# EasyEDA schematic ArduinoFile Schematic v2.json
TITLE: ProFile Interface Adapter - Arduino Mega Version; REV: 1.0; Date: 2021-08-20; Sheet: 1/1; Drawn By: AlexTheCat123; Company: N/A
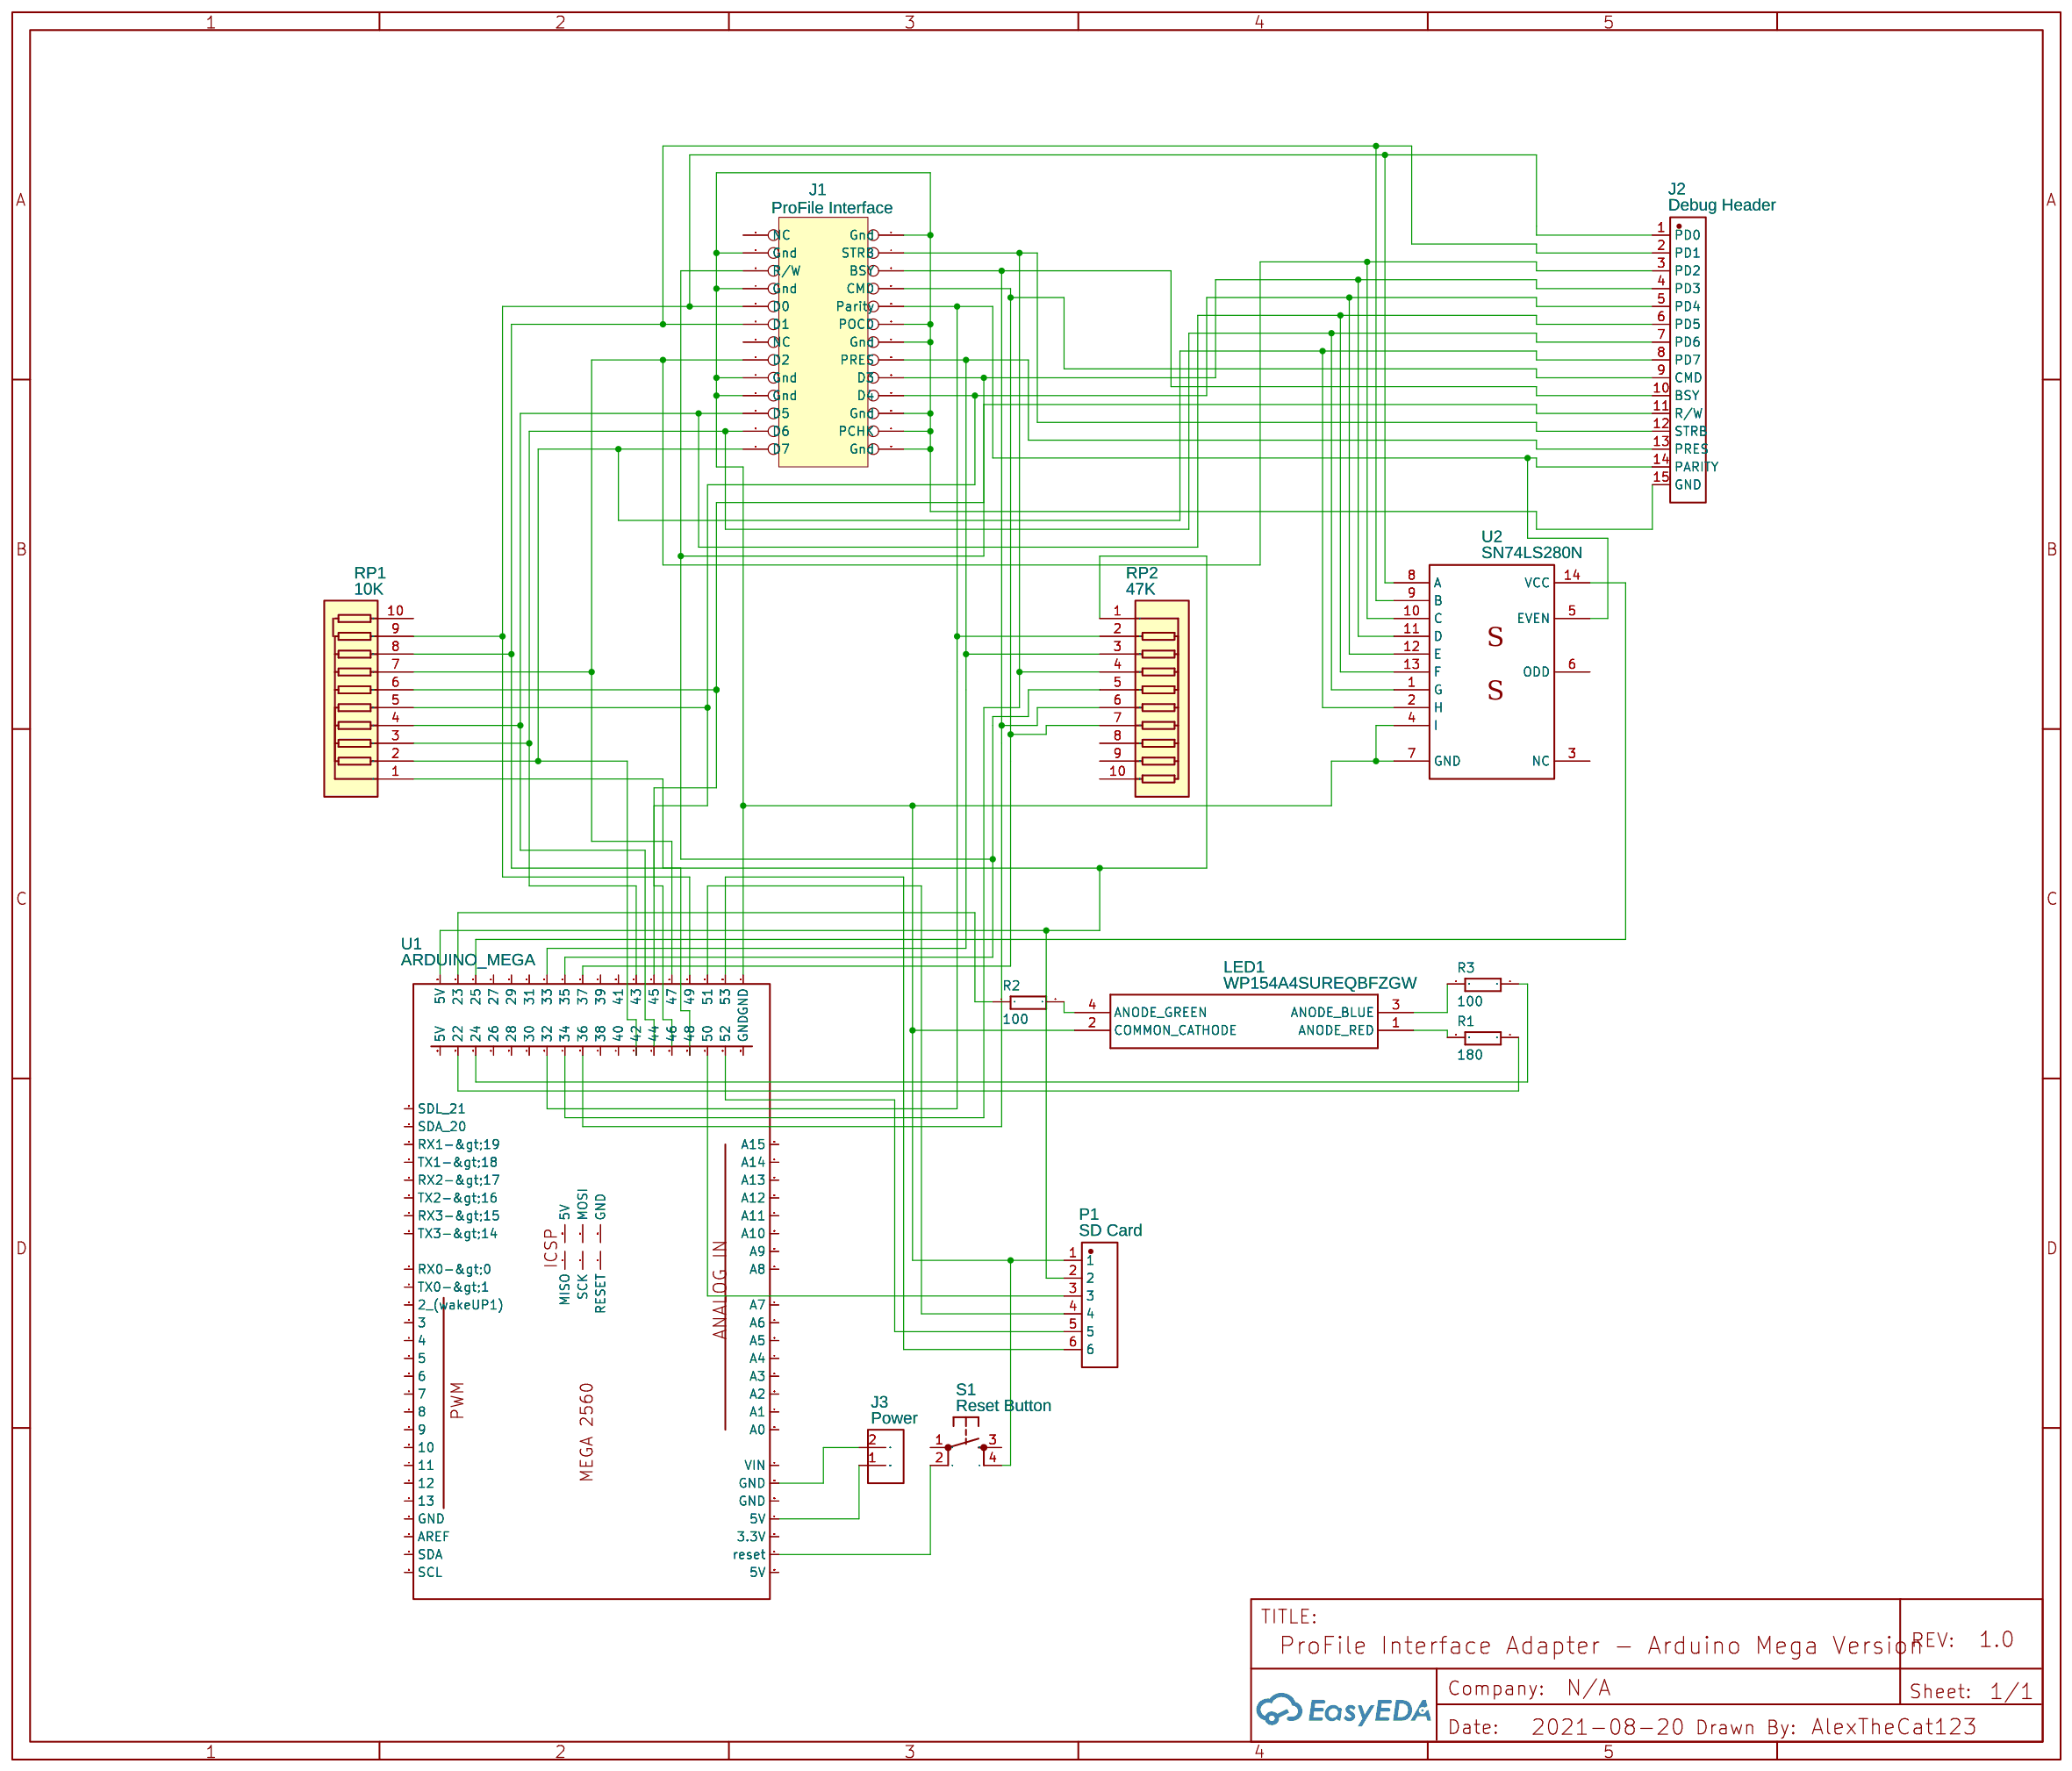
[diagram p0: schematic sheet]

## Parts
J1  ProFile Interface  [IDC26]
J2  Debug Header  [HDR-15X1/2.54]
J3  Power  [PINHEADER_02X1]
LED1  WP154A4SUREQBFZGW  [L-154A4SUREQBFZGEC]
P1  SD Card  [HDR-TH_6P-P2.54-V-F]
R1  180  [0204/7]
R2  100  [0204/7]
R3  100  [0204/7]
RP1  10K  [SIP-10]
RP2  47K  [SIP-10]
S1  Reset Button  [TACTILE-PTH]
U1  ARDUINO_MEGA  [ARDUINO_MEGA2560]
U2  SN74LS280N  [DIP14]

## Library data of the parts
J1 = HEADER 13X2
J2 = 1X15 HEADER: Contributor: ksatya37
J3 = pinheader02x1: Manufacturer Part: Pin_Header_5; Contributor: s1atbewie.de
LED1 = WP154A4SUREQBFZGW: Contributor: Michael Caiozzo
P1 = Header-Female-2.54_1x6: Supplier: LCSC; Manufacturer: BOOMELE; Manufacturer Part: Female header 1*6p; Supplier Part: C40877; JLCPCB Part Class: Extended Part
RP1 RP2 = 1K: Tolerance: ±5%; EasyEDA: E84206; Supplier Part: E84206; Supplier: EasyEDA; Manufacturer Part: A09-202JP
S1 = TAC_SWITCH: Contributor: SparkFun
U1 = ARDUINO_MEGA: Manufacturer Part: ARDUINO MEGA; Contributor: FARIAS LOZOYA CARLOSALEJANDRO
U2 = SN74LS280N: 9-Bit OddEven Parity GeneratorChecker

## Nets
Net-(J1-2): J1.2(Gnd) J1.3(Gnd) J1.7(Gnd) J1.12(POCD) J1.14(Gnd) J1.17(Gnd) J1.19(Gnd) J1.22(Gnd) J1.24(PCHK) J1.26(Gnd) J2.15(GND) J3.2(Vin) LED1.2(COMMON_CATHODE) P1.1 S1.4 U1.GND U2.4(I) U2.7(GND)
Net-(J1-4): J1.4(STRB) J2.12(STRB) RP2.4 U1.41(34)
Net-(J1-5): J1.5(R/W) J2.11(R/W) RP2.5 U1.42(35)
Net-(J1-6): J1.6(BSY) J2.10(BSY) RP2.6 U1.43(36)
Net-(J1-8): J1.8(CMD) J2.9(CMD) RP2.7 U1.44(37)
Net-(J1-9): J1.9(D0) J2.1(PD0) RP1.9 U1.56(49) U2.8(A)
Net-(J1-10): J1.10(Parity) J2.14(PARITY) RP2.2 U1.39(32) U2.5(EVEN)
Net-(J1-11): J1.11(D1) J2.2(PD1) RP1.8 U1.55(48) U2.9(B)
Net-(J1-15): J1.15(D2) J2.3(PD2) RP1.7 U1.54(47) U2.10(C)
Net-(J1-16): J1.16(PRES) J2.13(PRES) RP2.3 U1.40(33)
Net-(J1-18): J1.18(D3) J2.4(PD3) RP1.6 U1.53(46) U2.11(D)
Net-(J1-20): J1.20(D4) J2.5(PD4) RP1.5 U1.52(45) U2.12(E)
Net-(J1-21): J1.21(D5) J2.6(PD5) RP1.4 U1.51(44) U2.13(F)
Net-(J1-23): J1.23(D6) J2.7(PD6) RP1.3 U1.50(43) U2.1(G)
Net-(J1-25): J1.25(D7) J2.8(PD7) RP1.2 U1.49(42) U2.2(H)
Net-(J3-1): J3.1(Gnd) U1.5V
Net-(LED1-1): LED1.1(ANODE_RED) R1.1
Net-(LED1-3): LED1.3(ANODE_BLUE) R3.1
Net-(LED1-4): LED1.4(ANODE_GREEN) R2.2
Net-(P1-2): P1.2 RP1.1 RP2.1 U1.5V..(5V)
Net-(P1-3): P1.3 U1.57(50)
Net-(P1-4): P1.4 U1.58(51)
Net-(P1-5): P1.5 U1.59(52)
Net-(P1-6): P1.6 U1.60(53)
Net-(R1-2): R1.2 U1.29(22)
Net-(R2-1): R2.1 U1.30(23)
Net-(R3-2): R3.2 U1.31(24)
Net-(S1-2): S1.2 U1.84(reset)
Net-(U1-32): U1.32(25) U2.14(VCC)

Not connected (* = marked no-connect by the designer): J1 1(NC) 13(NC); RP1 10(9); RP2 8 9 10(9); S1 1 3; U1 3(AREF) 5(13) 5V.(5V) 5V...(5V) 5VICSP(5V) 6(12) 7(11) 8(10) 9 10(8) 11(7) 12(6) 13(5) 14(4) 15(3) 16(2 (wakeUP1)) 17(TX0->1) 18(RX0->0) 19(TX3->14) 20(RX3->15) 21(TX2->16) 22(RX2->17) 23(TX1->18) 24(RX1->19) 33(26) 34(27) 35(28) 36(29) 37(30) 38(31) 45(38) 46(39) 47(40) 48(41) 63(A15) 64(A14) 65(A13) 66(A12) 67(A11) 68(A10) 69(A9) 70(A8) 71(A7) 72(A6) 73(A5) 74(A4) 75(A3) 76(A2) 77(A1) 78(A0) 83(3.3V) 86(MISO) 87(SCK) 88(RESET) 90(MOSI) SCL SCL2(SDL 21) SDA SDA2(SDA 20) VIN; U2 3(NC) 6(ODD)
